# EAGLE board PROIECT_TSC (EAGLE 9.7.0)
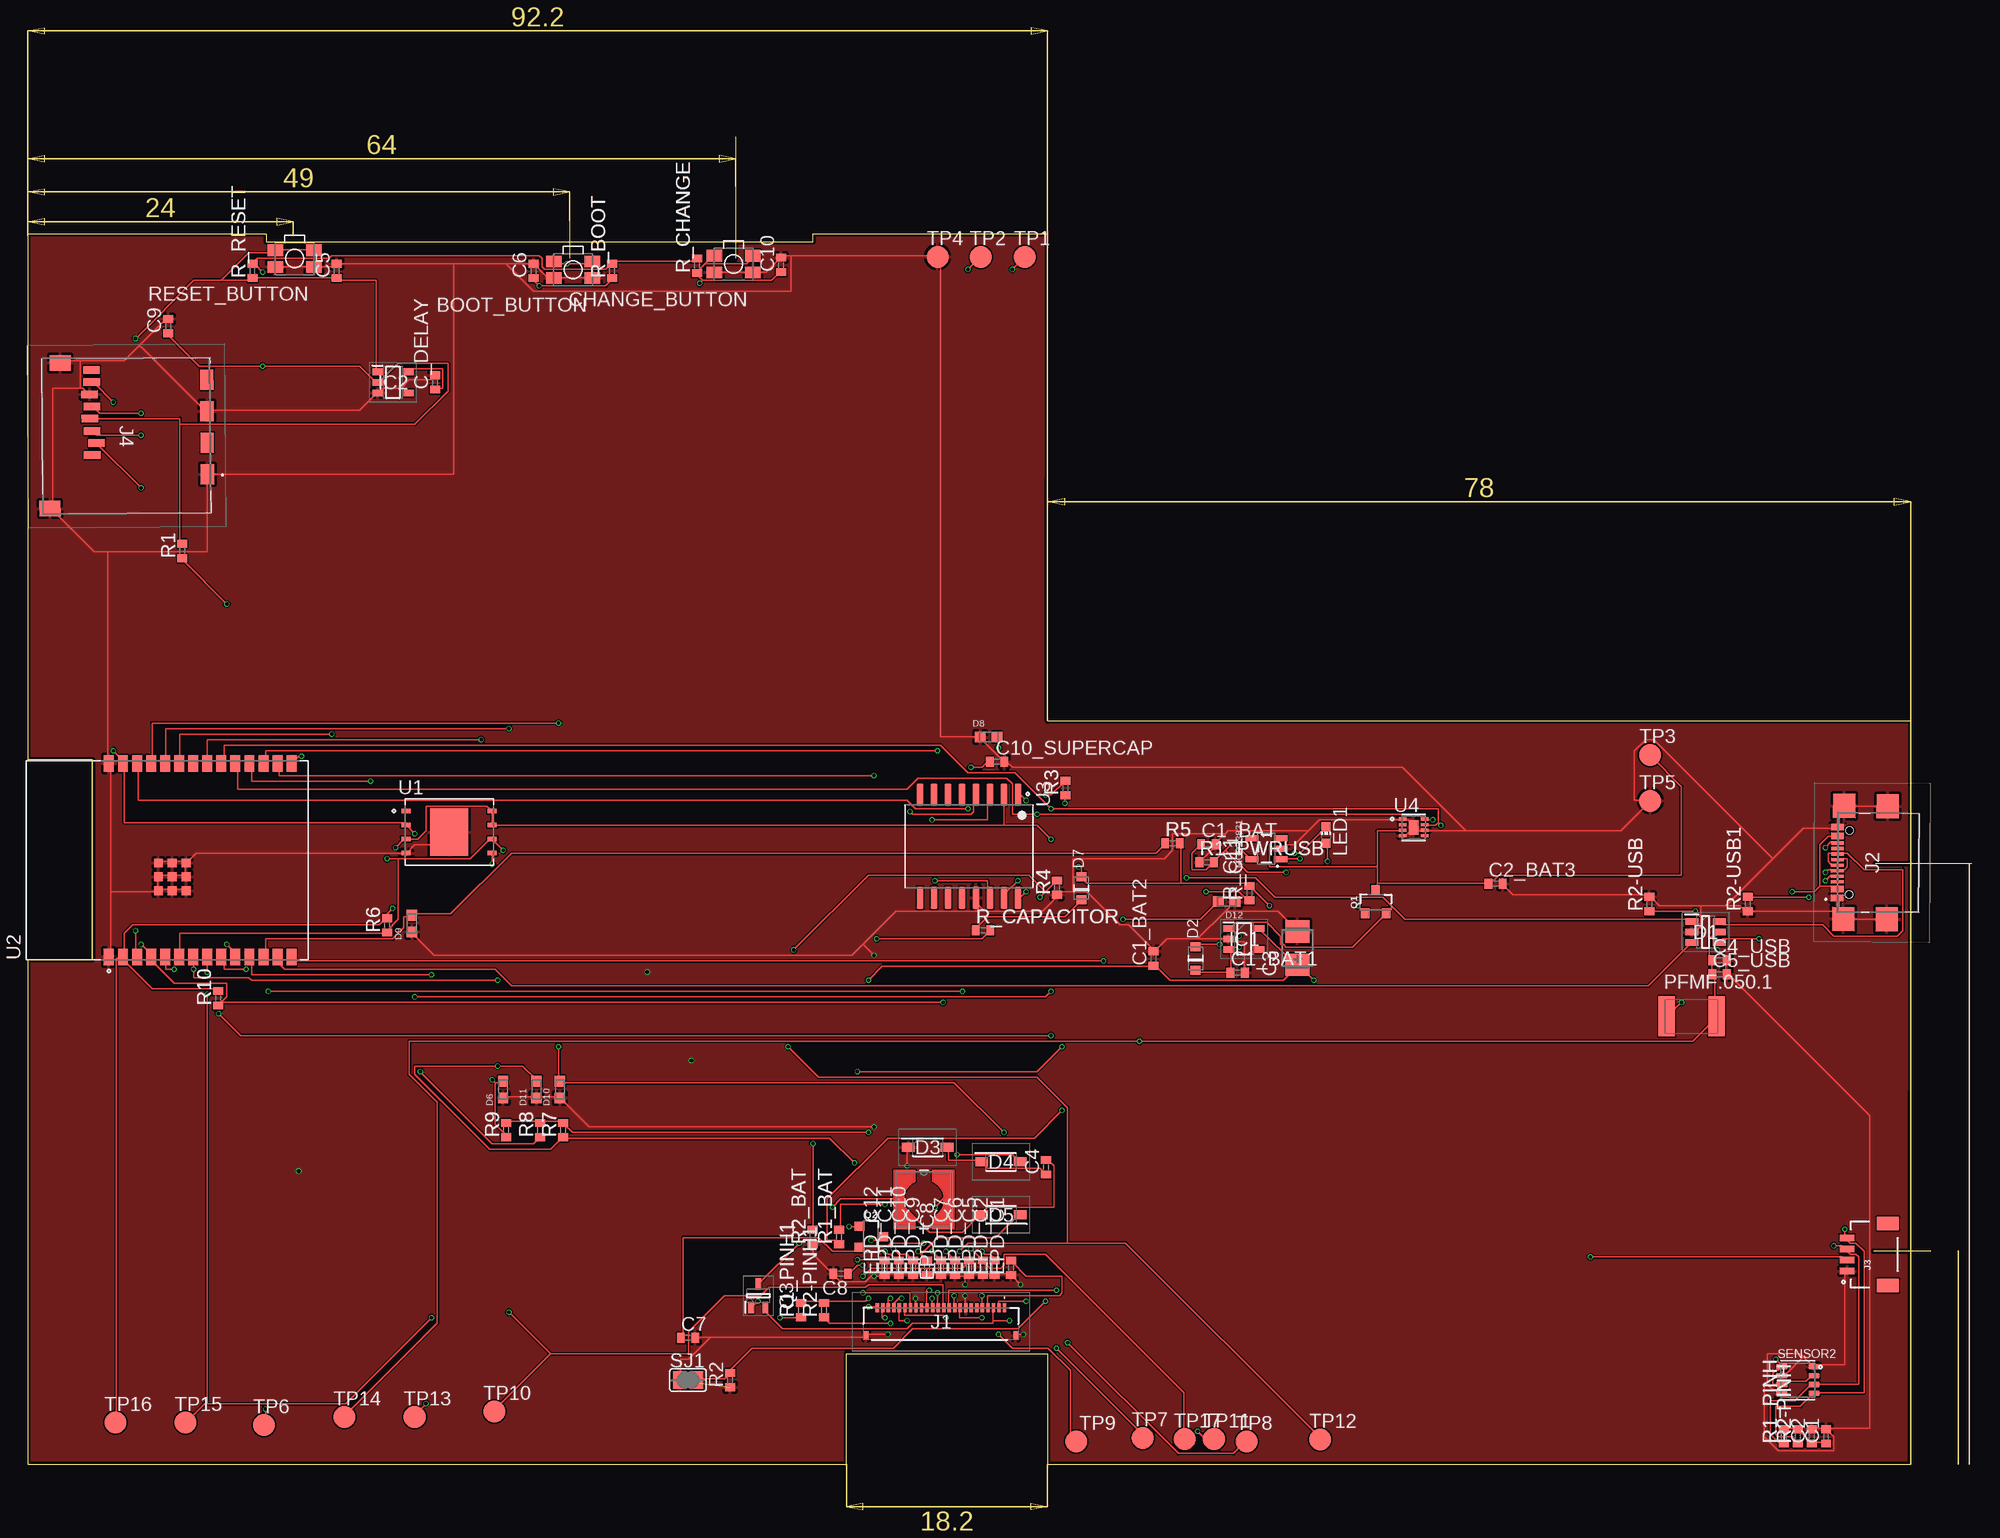
[diagram p1: board, top side]
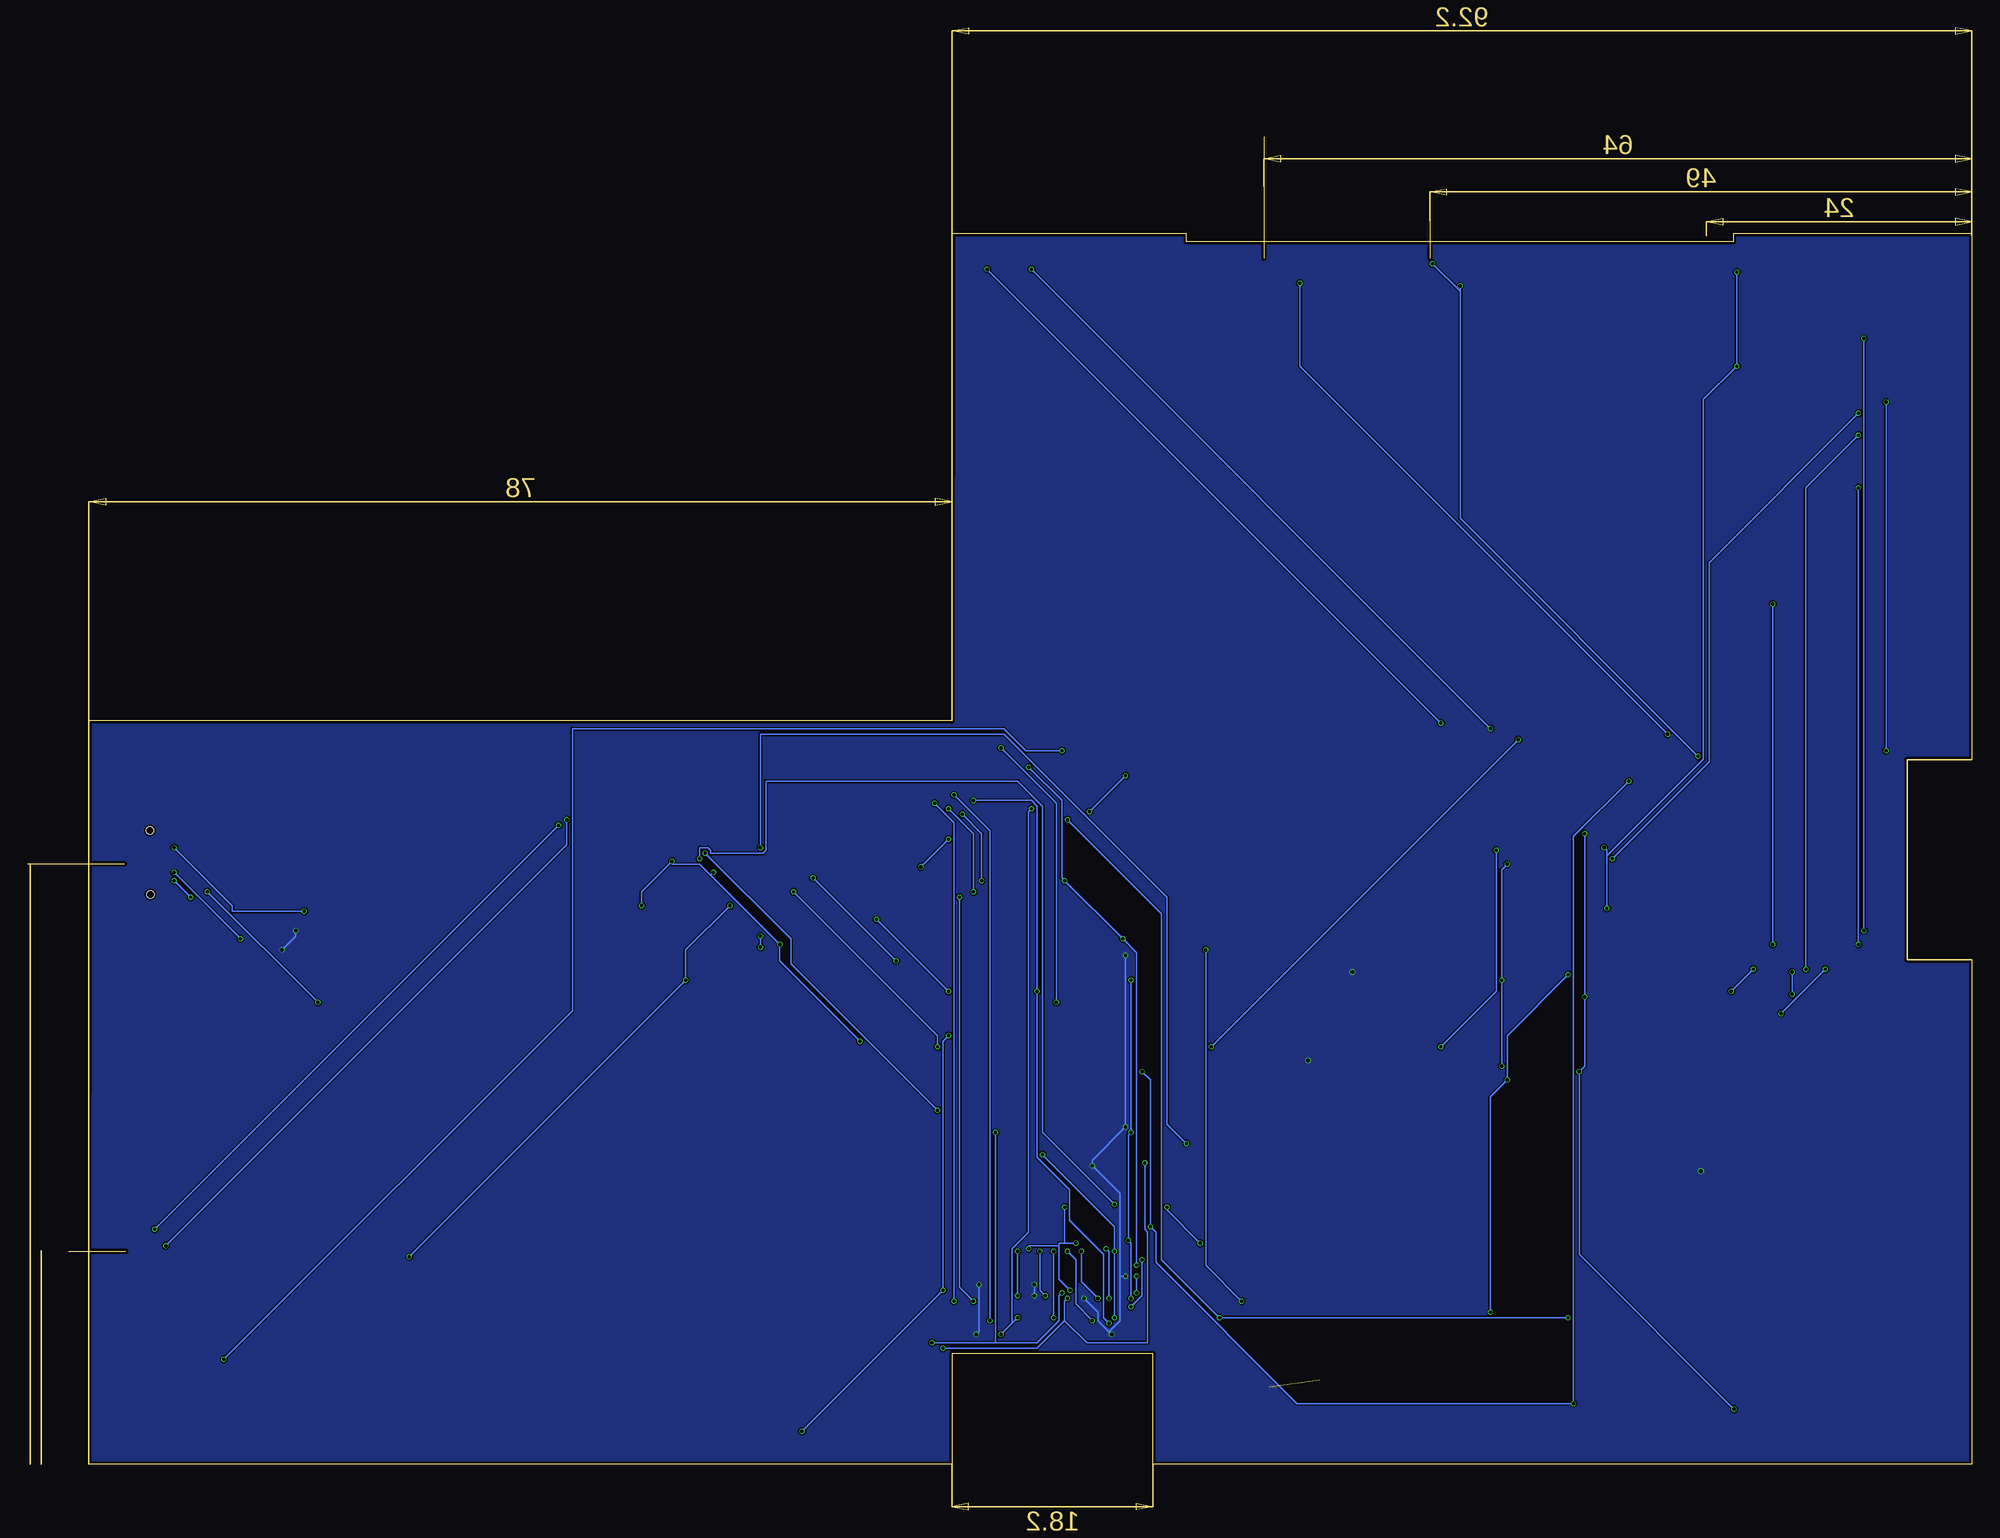
[diagram p2: board, bottom side, seen from below]

Size 175.74 x 120 mm. Coordinates in mm from the lower left corner, seen from the top.
Outline: 92.2,0 160,0
Outline: 0,100 0,63.68
Outline: 92.2,0 170.2,0 170.2,67.2 92.2,67.2 92.2,111.2 71,111.2 71,110.5 21.54,110.5 21.54,111.2 0,111.2 0,63.68
Outline: 92.2,0 92.2,10 74,10 74,0 0,0 0,45.63 5.86,45.63 5.86,63.68 0,63.68
Outline: 64,120 64,109
Outline: 49,115 49,109
Outline: 175.74,54.28 167,54.28
Outline: 172.01,19.28 166.86,19.28
Copper layers (1*16): Top 0.035mm / dielectric 1.6mm / Bottom 0.035mm
Design rules "jlcpcb-2layers": minimum track width 5mil, minimum drill 0.3mm, track to track 5mil, track to pad 5mil, pad to pad 5mil, via to via 5mil, smd to smd 5mil, copper to edge 0.2mm, drill to drill 6mil, minimum pad ring 10mil, minimum via ring 3mil, stop-mask expansion 4mil, vias tented up to drill 0mil, thermal gap 10mil

## Footprints (pad centres in the part's own frame; a part is rotated, then mirrored left to right if it is on the bottom)
MYBUTTON = smd 1.4 x 1.05: 1 1.75,0.75; 2 -1.75,0.75; 3 -1.75,-0.75; 4 1.75,-0.75
ESP32_WROVER_EAGLE-LTSPICE_C0402 = smd 0.7 x 0.9: 1 -0.65,0; 2 0.65,0
EAGLE-LTSPICE_C0402 = smd 0.7 x 0.9: 1 -0.65,0; 2 0.65,0
RCL_CT3528 = smd 2 x 2.2: + -1.5,0; - 1.5,0
SOT95P280X145-6N = smd 1.2 x 0.6: 1 -1.25,0.95; 2 -1.25,0; 3 -1.25,-0.95; 4 1.25,-0.95; 5 1.25,0; 6 1.25,0.95
ESP32_WROVER_AVX---SD0805S020S1R0_AVX_SD0805S020S1R0_0 = smd 0.8 x 0.9: 1 -1.05,0; 2 1.05,0
SOD3716X135N = smd 1.15 x 0.8: 1 -1.75,0; 2 1.75,0
DIOC1608X36N = smd 0.97 x 0.94: 1 -0.75,0; 2 0.75,0
SOT95P280X120-5N = smd 0.9 x 0.6: 1 -1.4,0.95; 2 -1.4,0; 3 -1.4,-0.95; 4 1.4,-0.95; 5 1.4,0.95
SOT95P280X125-5N = smd 0.9 x 0.6: 1 -1.4,0.95; 2 -1.4,0; 3 -1.4,-0.95; 4 1.4,-0.95; 5 1.4,0.95
FH34SRJ24S05SH99 = smd 0.3 x 0.8: 1 5.75,1.45; 2 5.25,1.45; 3 4.75,1.45; 4 4.25,1.45; 5 3.75,1.45; 6 3.25,1.45; 7 2.75,1.45; 8 2.25,1.45; 9 1.75,1.45; 10 1.25,1.45; 11 0.75,1.45; 12 0.25,1.45; 13 -0.25,1.45; 14 -0.75,1.45; 15 -1.25,1.45; 16 -1.75,1.45; 17 -2.25,1.45; 18 -2.75,1.45; 19 -3.25,1.45; 20 -3.75,1.45; 21 -4.25,1.45; 22 -4.75,1.45; 23 -5.25,1.45; 24 -5.75,1.45 | smd 0.4 x 0.8: MP1 6.75,-1.05; MP2 -6.75,-1.05
SAMACSYS_PARTS_USB4110GFA = smd 0.3 x 1.15: A1 -3.35,3.678; A4 -2.55,3.678; A5 -1.25,3.678; A6 -0.25,3.678; A7 0.25,3.678; A8 1.25,3.678; A9 2.55,3.678; A12 3.35,3.678; B1 3.05,3.678; B4 2.25,3.678; B5 1.75,3.678; B6 0.75,3.678; B7 -0.75,3.678; B8 -1.75,3.678; B9 -2.25,3.678; B12 -3.05,3.678 | smd 2.18 x 2: MP1 -5.11,-0.827; MP2 5.11,-0.827; MP3 -5.11,3.103; MP4 5.11,3.103 | hole 0.65: -2.89,2.603; 2.89,2.603
JST04_1MM_RA = smd 0.6 x 1.35: 1 -1.5,0; 2 -0.5,0; 3 0.5,0; 4 1.5,0 | smd 1.2 x 2: NC1 2.8,-3.675; NC2 -2.8,-3.675
112ATAARR03ATTEND = smd 1.8 x 1.2: G1 10.6,10.4; G2 4.9,10.4; S1 7.75,10.4; S2 2.05,10.4 | smd 1.4 x 1.9: G3 13.6,-3.85; G4 0.45,-2.85 | smd 0.7 x 1.5: P1 8.8,0; P2 7.7,0.4; P3 6.6,0; P4 5.5,-0.2; P5 4.4,0; P6 3.3,-0.2; P7 2.2,0; P8 1.1,0
IND_4828-WE-TPC_WRE = smd 0.127 x 0.127: 1 -2.286,0; 2 2.286,0
ADAFRUIT_CHIP-LED0603 = smd 0.8 x 0.8: A 0,-0.75; C 0,0.75
ESP32_WROVER_SPARKFUN-IC-POWER_SOT23-5 = smd 0.55 x 1.2: 1 -0.95,-1.3; 2 0,-1.3; 3 0.95,-1.3; 4 0.95,1.3; 5 -0.95,1.3
ESP32C6_VARISTOR_CT/CN1812 = smd 1.5 x 3.6: 1 -2.25,0; 2 2.25,0
ESP32_WROVER_SPARKFUN-DISCRETESEMI_SOT23-3 = smd 0.8 x 0.9: 1 -0.95,-1; 2 0.95,-1; 3 0,1.1
SOT65P210X110-3N = smd 1.05 x 0.5: 1 -1.05,0.65; 2 -1.05,-0.65; 3 1.05,0
ESP32_WROVER_EAGLE-LTSPICE_R0402 = smd 0.7 x 0.9: 1 -0.65,0; 2 0.65,0
ESP32_WROVER_BME680_PSON80P300X300X100-8N = smd 1.016 x 0.5: 1 1.458,1.2; 2 1.458,0.4; 3 1.458,-0.4; 4 1.458,-1.2; 5 -1.458,-1.22; 6 -1.458,-0.4; 7 -1.458,0.4; 8 -1.458,1.2
SJ = smd 1.168 x 1.6: 1 -0.762,0; 2 0.762,0
TP20R = smd 2 x 2: TP 0,0
SON127P600X800X80-9N = smd 0.94 x 0.44: 1 -3.895,1.905; 2 -3.895,0.635; 3 -3.895,-0.635; 4 -3.895,-1.905; 5 3.895,-1.905; 6 3.895,-0.635; 7 3.895,0.635; 8 3.895,1.905 | smd 3.4 x 4.3: 9 0,0
XCVR_ESP32-C6-WROOM-1-N8 = smd 1.5 x 0.9: 1 -8.75,5.26; 2 -8.75,3.99; 3 -8.75,2.72; 4 -8.75,1.45; 5 -8.75,0.18; 6 -8.75,-1.09; 7 -8.75,-2.36; 8 -8.75,-3.63; 9 -8.75,-4.9; 10 -8.75,-6.17; 11 -8.75,-7.44; 12 -8.75,-8.71; 13 -8.75,-9.98; 14 -8.75,-11.25; 15 8.75,-11.25; 16 8.75,-9.98; 17 8.75,-8.71; 18 8.75,-7.44; 19 8.75,-6.17; 20 8.75,-4.9; 21 8.75,-3.63; 22 8.75,-2.36; 23 8.75,-1.09; 24 8.75,0.18; 25 8.75,1.45; 26 8.75,2.72; 27 8.75,3.99; 28 8.75,5.26 | smd 0.8 x 0.8: 29_1 -2.755,0.79; 29_2 -1.505,0.79; 29_3 -0.255,0.79; 29_4 -2.755,-0.46; 29_5 -1.505,-0.46; 29_6 -0.255,-0.46; 29_7 -2.755,-1.71; 29_8 -1.505,-1.71; 29_9 -0.255,-1.71
SOIC127P1032X265-16N = smd 2.05 x 0.59: 1 -4.655,4.445; 2 -4.655,3.175; 3 -4.655,1.905; 4 -4.655,0.635; 5 -4.655,-0.635; 6 -4.655,-1.905; 7 -4.655,-3.175; 8 -4.655,-4.445; 9 4.655,-4.445; 10 4.655,-3.175; 11 4.655,-1.905; 12 4.655,-0.635; 13 4.655,0.635; 14 4.655,1.905; 15 4.655,3.175; 16 4.655,4.445
SON50P200X200X80-9N = smd 0.76 x 0.27: 1 -0.985,0.75; 2 -0.985,0.25; 3 -0.985,-0.25; 4 -0.985,-0.75; 5 0.985,-0.75; 6 0.985,-0.25; 7 0.985,0.25; 8 0.985,0.75 | smd 0.9 x 1.3: 9 0,0

## Placement (x,y rotation side)
BOOT_BUTTON  BUTTON_CUSYOMV1  [MYBUTTON]  49.3,107.97 180 top
C1  100nF  [ESP32_WROVER_EAGLE-LTSPICE_C0402]  162.56,2.54 90 top
C1_BAT  4.7uF  [ESP32_WROVER_EAGLE-LTSPICE_C0402]  106.73,56.05 0 top
C1_BAT1  4.7uF  [ESP32_WROVER_EAGLE-LTSPICE_C0402]  109.38,44.45 0 top
C1_BAT2  4.7uF  [EAGLE-LTSPICE_C0402]  101.76,45.72 90 top
C2  100nF  [ESP32_WROVER_EAGLE-LTSPICE_C0402]  161.29,2.54 90 top
C2_BAT3  4.7uF  [ESP32_WROVER_EAGLE-LTSPICE_C0402]  132.68,52.47 0 top
C3  100uF  [RCL_CT3528]  114.77,46.66 90 top
C4  4.7uF/25V  [ESP32_WROVER_EAGLE-LTSPICE_C0402]  92.06,26.86 90 top
C4_USB  100nF  [EAGLE-LTSPICE_C0402]  152.94,45.57 0 top
C5  1uF  [ESP32_WROVER_EAGLE-LTSPICE_C0402]  27.94,107.86 90 top
C5_USB  4.7uF  [EAGLE-LTSPICE_C0402]  152.94,44.3 0 top
C6  100nF  [ESP32_WROVER_EAGLE-LTSPICE_C0402]  45.72,107.86 90 top
C7  10uF  [EAGLE-LTSPICE_C0402]  59.69,11.43 0 top
C8  100nF  [ESP32_WROVER_EAGLE-LTSPICE_C0402]  73.48,17.23 180 top
C9  100nF  [ESP32_WROVER_EAGLE-LTSPICE_C0402]  12.7,102.87 90 top
C10  100nF  [ESP32_WROVER_EAGLE-LTSPICE_C0402]  68.12,108.41 90 top
C10_SUPERCAP  [ESP32_WROVER_EAGLE-LTSPICE_C0402]  87.63,63.5 0 top
C_DELAY  100nF  [ESP32_WROVER_EAGLE-LTSPICE_C0402]  36.83,97.79 90 top
CHANGE_BUTTON  BUTTON_CUSYOMV1  [MYBUTTON]  63.8,108.47 180 top
D1  USBLC6-2SC6Y  [SOT95P280X145-6N]  151.67,48.11 0 top
D2  ESP32_WROVER_AVX---SD0805S020S1R0_AVX_SD0805S020S1R0_0_0AVX_SD0805S020S1R0_0_0  [ESP32_WROVER_AVX---SD0805S020S1R0_AVX_SD0805S020S1R0_0]  105.57,45.72 90 top
D3  MBR0530  [SOD3716X135N]  81.36,28.67 0 top
D4  MBR0530  [SOD3716X135N]  87.98,27.36 0 top
D5  MBR0530  [SOD3716X135N]  87.98,22.55 180 top
D6  PGB1010603MR  [DIOC1608X36N]  42.98,33.87 90 top
D7  ESP32_WROVER_AVX---SD0805S020S1R0_AVX_SD0805S020S1R0_0_0AVX_SD0805S020S1R0_0_0  [ESP32_WROVER_AVX---SD0805S020S1R0_AVX_SD0805S020S1R0_0]  95.25,52.07 90 top
D8  PGB1010603MR  [DIOC1608X36N]  86.86,65.74 0 top
D9  PGB1010603MR  [DIOC1608X36N]  34.74,48.87 90 top
D10  PGB1010603MR  [DIOC1608X36N]  48.12,33.87 90 top
D11  PGB1010603MR  [DIOC1608X36N]  46,33.87 90 top
D12  PGB1010603MR  [DIOC1608X36N]  108.38,50.87 180 top
EPD_C1  1uF/50V  [ESP32_WROVER_EAGLE-LTSPICE_C0402]  88.9,17.78 90 top
EPD_C2  1uF/50V  [ESP32_WROVER_EAGLE-LTSPICE_C0402]  87.41,17.78 90 top
EPD_C5  1uF/50V  [ESP32_WROVER_EAGLE-LTSPICE_C0402]  86.36,17.78 90 top
EPD_C6  1uF/50V  [ESP32_WROVER_EAGLE-LTSPICE_C0402]  85.09,17.78 90 top
EPD_C7  1uF/50V  [ESP32_WROVER_EAGLE-LTSPICE_C0402]  83.82,17.78 90 top
EPD_C8  1uF/50V  [ESP32_WROVER_EAGLE-LTSPICE_C0402]  82.55,17.78 90 top
EPD_C9  1uF/50V  [ESP32_WROVER_EAGLE-LTSPICE_C0402]  81.28,17.78 90 top
EPD_C10  1uF/50V  [ESP32_WROVER_EAGLE-LTSPICE_C0402]  80.01,17.78 90 top
EPD_C11  1uF/50V  [ESP32_WROVER_EAGLE-LTSPICE_C0402]  78.74,17.78 90 top
EPD_C12  1uF/50V  [ESP32_WROVER_EAGLE-LTSPICE_C0402]  77.47,17.78 90 top
IC1  XC6220A331MR-G  [SOT95P280X120-5N]  109.96,47.49 0 top
IC2  BD5229G-TR  [SOT95P280X125-5N]  33.02,97.79 0 top
J1  FH34SRJ-24S-0.5SH_99_  [FH34SRJ24S05SH99]  82.55,12.7 0 top
J2  SAMACSYS_PARTS_USB4110-GF-A  [SAMACSYS_PARTS_USB4110GFA]  167.26,54.38 89.6 top
J3  QWIIC_RIGHT_ANGLE  [JST04_1MM_RA]  164.46,18.97 90 top
J4  112A-TAAR-R03_ATTEND  [112ATAARR03ATTEND]  5.78,100.01 270.4 top
L1  68uH  [IND_4828-WE-TPC_WRE]  81.01,23.94 0 top
LED1  [ADAFRUIT_CHIP-LED0603]  117.36,56.89 0 top
MCP73831  ESP32_WROVER_SPARKFUN-IC-POWER_MCP73831  [ESP32_WROVER_SPARKFUN-IC-POWER_SOT23-5]  111.96,55.65 90 top
PFMF.050.1  ESP32C6_VARISTORCN1812  [ESP32C6_VARISTOR_CT/CN1812]  150.4,40.49 0 top
Q1  20V/4.2A/52mΩ/1.4W  [ESP32_WROVER_SPARKFUN-DISCRETESEMI_SOT23-3]  121.85,50.8 0 top
Q2  20V/4.2A/52mΩ/1.4W  [ESP32_WROVER_SPARKFUN-DISCRETESEMI_SOT23-3]  76.2,20.59 270 top
Q3  SI1308EDL-T1-GE3  [SOT65P210X110-3N]  66.04,15.24 90 top
R1  10K  [ESP32_WROVER_EAGLE-LTSPICE_R0402]  13.97,82.55 90 top
R1_BAT  200  [ESP32_WROVER_EAGLE-LTSPICE_R0402]  73.34,20.55 90 top
R1_PINH  10K  [ESP32_WROVER_EAGLE-LTSPICE_R0402]  158.75,2.54 90 top
R1_PINH1  10K  [ESP32_WROVER_EAGLE-LTSPICE_R0402]  69.89,13.95 90 top
R1_PWRUSB  100k  [ESP32_WROVER_EAGLE-LTSPICE_R0402]  106.58,54.42 0 top
R2  2.2  [ESP32_WROVER_EAGLE-LTSPICE_R0402]  63.5,7.62 90 top
R2-PINH  10K  [ESP32_WROVER_EAGLE-LTSPICE_R0402]  160.02,2.54 90 top
R2-PINH1  10K  [ESP32_WROVER_EAGLE-LTSPICE_R0402]  71.97,13.95 90 top
R2-USB  5K1  [ESP32_WROVER_EAGLE-LTSPICE_R0402]  146.59,50.65 90 top
R2-USB1  5K1  [ESP32_WROVER_EAGLE-LTSPICE_R0402]  155.48,50.65 90 top
R2_BAT  2K  [ESP32_WROVER_EAGLE-LTSPICE_R0402]  70.95,20.55 90 top
R3  0.47  [ESP32_WROVER_EAGLE-LTSPICE_R0402]  93.8,61.13 90 top
R4  10K  [ESP32_WROVER_EAGLE-LTSPICE_R0402]  93.06,52.13 90 top
R5  10K  [ESP32_WROVER_EAGLE-LTSPICE_R0402]  103.48,56.13 0 top
R6  10K  [ESP32_WROVER_EAGLE-LTSPICE_R0402]  32.49,48.71 90 top
R7  10K  [ESP32_WROVER_EAGLE-LTSPICE_R0402]  48.41,30.21 90 top
R8  10K  [ESP32_WROVER_EAGLE-LTSPICE_R0402]  46.33,30.21 90 top
R9  10K  [ESP32_WROVER_EAGLE-LTSPICE_R0402]  43.25,30.21 90 top
R10  10K  [ESP32_WROVER_EAGLE-LTSPICE_R0402]  17.22,42.13 90 top
R_BOOT  10K  [ESP32_WROVER_EAGLE-LTSPICE_R0402]  52.84,107.86 90 top
R_C11  10K  [ESP32_WROVER_EAGLE-LTSPICE_R0402]  110.45,51.63 90 top
R_CAPACITOR  15  [ESP32_WROVER_EAGLE-LTSPICE_R0402]  86.36,48.26 0 top
R_CHANGE  10K  [ESP32_WROVER_EAGLE-LTSPICE_R0402]  60.5,108.32 90 top
R_RESET  10K  [ESP32_WROVER_EAGLE-LTSPICE_R0402]  20.32,107.86 90 top
RESET_BUTTON  BUTTON_CUSYOMV1  [MYBUTTON]  24.13,108.97 180 top
SENSOR2  ESP32_WROVER_BME680_BME680  [ESP32_WROVER_BME680_PSON80P300X300X100-8N]  160.02,7.62 0 top
SJ1  [SJ]  59.69,7.62 0 top
TP1  TPTP20R  [TP20R]  90.13,109.13 0 top
TP2  TPTP20R  [TP20R]  86.13,109.13 0 top
TP3  TPTP20R  [TP20R]  146.67,64.13 0 top
TP4  TPTP20R  [TP20R]  82.26,109.13 0 top
TP5  TPTP20R  [TP20R]  146.67,59.96 0 top
TP6  TPTP20R  [TP20R]  21.36,3.57 0 top
TP7  TPTP20R  [TP20R]  100.78,2.39 0 top
TP8  TPTP20R  [TP20R]  110.2,2.07 0 top
TP9  TPTP20R  [TP20R]  94.77,2.07 0 top
TP10  TPTP20R  [TP20R]  42.18,4.78 0 top
TP11  TPTP20R  [TP20R]  107.23,2.28 0 top
TP12  TPTP20R  [TP20R]  116.83,2.25 0 top
TP13  TPTP20R  [TP20R]  34.98,4.28 0 top
TP14  TPTP20R  [TP20R]  28.63,4.28 0 top
TP15  TPTP20R  [TP20R]  14.28,3.78 0 top
TP16  TPTP20R  [TP20R]  7.93,3.78 0 top
TP17  TPTP20R  [TP20R]  104.58,2.28 0 top
U1  W25Q512JVEIQ  [SON127P600X800X80-9N]  38.1,57.15 0 top
U2  ESP32-C6-WROOM-1-N8  [XCVR_ESP32-C6-WROOM-1-N8]  12.61,54.61 90 top
U3  DS3231SN#  [SOIC127P1032X265-16N]  85.09,55.88 270 top
U4  MAX17048G+T10  [SON50P200X200X80-9N]  125.28,57.57 0 top

## Tracks (layer width: path | path; a pad name or v marks a point on that pad's centre or on a via)
2C_PW
  Top 0.127: C1.1 162.5,2 161.5,2 C2.1 161.25,2 160.25,3 R2-PINH.2 160,3.25 158.75,3.25 R1_PINH.2
3V3  (via drill 0.3)
  Top 0.127: R9.2 43.25,31 46.25,31 R8.2 46.5,31 48.25,31 R7.2 48.5,30.75 49.25,30 v76,30 | R1_PINH1.2 70,14.75 71.75,14.75 R2-PINH1.2 72,14.75 75.75,14.75 v76,15 | v76.25,20.25 77,20.25 77.25,20.5 Q2.3 | 104.25,52.5 110.25,52.5 R_C11.2 110.5,52.25 v112.25,50.5 | 104.25,52.5 95.75,52.5 95.25,53 D7.2 95.25,54 v95,54 | 104.25,52.5 104.25,56 R5.2 | C3.+ 114.75,45 113.5,43.75 103.25,43.75 102,45 C1_BAT2.1 101.75,45 77.25,45 v76,43.75 | IC1.5 111.5,48.25 114.5,45.25 114.75,45.25 C3.+ | v141.25,18.75 164,18.75 164.25,18.5 J3.2 | v116.25,43.75 115,45 C3.+ | R_CHANGE.2 60.5,108.75 53,108.75 R_BOOT.2 52.75,108.5 52.25,108 46.75,108 46.5,108.25 46.5,109 46.25,109.25 27.5,109.25 27.25,109 20.75,109 20.5,108.75 R_RESET.2 20.5,108.5 v21.25,107.75 | 13.75,94 13.75,94.5 5.75,94.5 J4.P4 | 13.75,94 13.75,83.25 R1.2 | C9.1 12.75,102 15.5,99.25 v21.25,99.25 30,99.25 31.25,98 31.5,98 IC2.2 31.75,98 32,98 33.5,99.5 38,99.5 38,97 35,94 13.75,94 | 88.25,57.75 88.25,60.5 U3.2 | 88.25,57.75 42,57.75 U1.7 42,58 42,59 U1.8 41.75,59.25 41.5,59.5 36,59.5 36,57.25 35.25,56.5 34.25,56.5 U1.3 34,56.5 v33.25,55.75 | 8.5,45.75 11.25,43 17,43 R10.2 | 8.5,45.75 8,45.75 8,4 TP16.TP | 8.5,45.75 U2.2 8.75,46 8.75,48 9.5,48.75 31.75,48.75 32.25,49.25 R6.2 32.25,49.5 v33,50.25 | v92.5,56.5 91.25,57.75 88.25,57.75
  Bottom 0.127: v76,15 76,20 v76.25,20.25 76.25,29.75 v76,30 v76,43.75 | v141.25,18.75 v116.25,43.75 116.25,46.5 v112.25,50.5 | v21.25,107.75 v21.25,99.25 24.25,96.25 24.25,63.75 33,55 | v33.25,55.75 33,55.5 33,55 | v33,50.25 33,55 | v92.5,56.5 v95,54
32KHZ  (via drill 0.3)
  Top 0.127: v78,12.75 72.5,12.75 72,13.25 R2-PINH1.1 | v90.25,60 89.75,60.5 U3.1 | v19.75,44.75 17.75,44.75 17.75,45.75 U2.9 | v84.5,42.75 v21.75,42.75
  Bottom 0.127: v78,12.75 78.5,13.25 78.5,19 81.58,22.08 81.58,24.83 84.5,27.75 v84.5,42.75 84.5,59.5 85,60 v90.25,60 | v21.75,42.75 v19.75,44.75
DN  (via drill 0.3)
  Top 0.127: J2.A7 163.75,54.75 164.5,54.75 164.5,54 164.25,53.75 163.75,53.75 J2.B7 163.5,53.75 162.75,53.75 v162.5,53.5 | v156.5,47.5 153.25,47.5 153,47.25 D1.4
  Bottom 0.127: v162.5,53.5 v156.5,47.5
DP
  Top 0.127: J2.A6 163.5,54.25 163,54.25 162.75,54.5 162.75,55.25 163.5,55.25 J2.B6 163.75,55.25 164.5,55.25 166,53.75 169.5,53.75 169.5,48.25 169,47.75 163.25,47.75 162.25,48.75 153.25,48.75 153,49 D1.6
EPD_3V3  (via drill 0.3)
  Top 0.127: C7.1 59.25,11.5 59.25,20.5 71.5,20.5 72.75,19.25 74.75,19.25 75,19.5 Q2.2 75.25,19.75 77.75,19.75 78,20 v81,20 | 81.25,14.25 80.75,14.25 J1.16 | 81.25,14.25 81.25,15.75 v81.5,15.75 | v82,23.25 83.03,24.28 L1.2 | 81.25,14.25 J1.15 | TP17.TP 104.5,2.5 104.5,6.5 92,19 88.25,19 88.25,18 88,17.75 87,17.75 86.5,18.25 EPD_C5.2 86.25,18.5 v85.25,19.5
  Bottom 0.127: v81.5,15.75 82.5,16.75 82.5,19.75 | v82,23.25 82,20 | 82.5,19.75 82.5,20 82,20 | 82.5,19.75 85.25,19.75 v85.25,19.5 | 82,20 v81,20
EPD_3V3_C  (via drill 0.3)
  Top 0.127: v74.25,21.5 75,21.5 Q2.1 | v36,5.5 35,4.5 TP13.TP | v106.5,51.75 109.5,51.75 110.25,51 R_C11.1 | v93.5,37.75 91.25,35.5 v75,35.5 | v31,61.75 20.25,61.75 20.25,63.25 U2.18
  Bottom 0.127: v106.5,51.75 93.5,38.75 v93.5,37.75 | v75,35.5 74.25,34.75 v74.25,21.5 73.75,21 73.75,18.25 61,5.5 v36,5.5 36,56.75 v31,61.75
EPD_BUSY  (via drill 0.3)
  Top 0.127: v86.25,13.25 84.25,13.25 84.25,14 J1.9 | v87.75,11.75 89,10.5 92.25,10.5 94.25,8.5 94.25,2.25 94.75,2.25 TP9.TP | v85,59.25 80.25,59.25 79.5,60 10,60 10,63.25 U2.26
  Bottom 0.127: v87.75,11.75 86.75,12.75 | 86.75,12.75 v86.25,13.25 | v85,59.25 85.25,59 85.25,21 86.75,19.5 86.75,12.75
EPD_CS  (via drill 0.3)
  Top 0.127: 42.25,34.5 42.25,30.75 43.25,29.75 R9.1 | 42.25,34.5 42.75,34.5 D6.2 | v36.5,44.25 20.25,44.25 20.25,45.75 U2.11 | 42.25,34.5 v42,34.75 | 47.25,10 59.75,10 59.75,12 63,15.25 66.25,15.25 67,16 75.75,16 76,16.25 82.75,16.25 82.75,14.25 J1.12 | 47.25,10 42.25,5 TP10.TP | 47.25,10 v43.5,13.75
  Bottom 0.127: v36.5,44.25 42,38.75 v42,34.75 43.5,33.25 v43.5,13.75
EPD_DC  (via drill 0.3)
  Top 0.127: v93,15.75 83.25,15.75 83.25,14.25 J1.11 | v105.75,3 106.25,2.5 107,2.5 TP11.TP | v13.25,44.75 12.5,44.75 12.5,45.75 U2.5 | v17.25,40.75 19.25,38.75 v92.5,38.75
  Bottom 0.127: v105.75,3 v93,15.75 93,38.25 v92.5,38.75 | v17.25,40.75 v13.25,44.75
EPD_RST  (via drill 0.3)
  Top 0.127: v83.75,15.25 83.75,14.25 J1.10 | v84.25,19.25 85,20 94,20 | 94,20 99.25,20 116.75,2.5 TP12.TP | v41,65.5 16.25,65.5 16.25,63.5 U2.21 | v68.75,37.75 71.5,35 91.25,35 94,32.25 94,20
  Bottom 0.127: v83.75,15.25 84.25,15.75 v84.25,19.25 | v68.75,37.75 v41,65.5
FLASH_CS
  Top 0.127: R5.1 102.75,56 102,55.25 43.75,55.25 38.25,49.75 34.75,49.75 D9.2 34.5,49.5 34,49.5 34,48.5 33,47.5 21.5,47.5 21.5,46 U2.12
GDR  (via drill 0.3)
  Top 0.127: v90.25,14.75 87.75,14.75 87.75,14.25 J1.2 | 92,51.75 93,52.75 R4.2 | 92,51.75 v91.5,51.25 | v66,14.75 65.5,14.25 Q3.1 | v69.25,46.5 76,53.25 90.5,53.25 92,51.75
  Bottom 0.127: v90.25,14.75 91.5,16 v91.5,51.25 | v66,14.75 69.25,18 v69.25,46.5
GND  (via drill 0.3, 0.35)  (1 unrouted)
  Top 0.127: CHANGE_BUTTON.1 62.25,107.75 65.5,107.75 CHANGE_BUTTON.2 65.75,107.75 66.75,107.75 68,109 C10.2 68.25,109.25 69,109.25 | 69,109.25 82.25,109.25 TP4.TP 82.5,109 82.5,65.75 86,65.75 D8.1 86.25,65.5 88.25,63.5 C10_SUPERCAP.2 88.5,63.5 89,63 124.25,63 130,57.25 | RESET_BUTTON.1 22.5,108.25 25.75,108.25 RESET_BUTTON.2 26,108.25 27.5,108.25 27.75,108.5 C5.2 28,108.5 38.5,108.5 | BOOT_BUTTON.2 51,107.25 47.75,107.25 BOOT_BUTTON.1 47.5,107.25 47,107.25 45.75,108.5 C6.2 45.5,108.5 43.25,108.5 | 43.25,108.5 38.5,108.5 | 69,109.25 69,106 45.75,106 43.25,108.5 | U1.9 38,57 37,56 35,56 34.25,55.25 U1.4 34,55.25 15.25,55.25 14.5,54.5 U2.29_9 | U2.29_3 12,54.5 13,54.5 U2.29_6 13.25,54.5 14.25,54.5 U2.29_9 | U2.29_1 11.75,52 11.75,53 U2.29_2 12,53.25 13,53.25 U2.29_5 13.25,53.25 14.25,53.25 | U2.29_1 12,52 13,52 U2.29_4 13.25,52 14.25,52 U2.29_7 | 7.5,51.75 7.5,46 U2.1 | 7.5,51.75 11.75,51.75 U2.29_1 | 7.5,51.75 7.5,63.25 U2.28 7.25,63.5 7.25,82.5 | 14.25,53.25 14.25,54.25 U2.29_9 | 14.25,53.25 U2.29_8 | 7.25,82.5 6,82.5 2.25,86.25 J4.G3 2.25,86.5 2.25,97.25 4.75,97.25 | 7.25,82.5 16.25,82.5 16.25,89.25 J4.G1 16.5,89.5 38.5,89.5 38.5,108.5 | C_DELAY.2 36.75,98.25 36.5,98 34.5,98 33.75,97.25 32,97.25 31.75,97 IC2.3 31.5,96.75 30,95.25 16.25,95.25 J4.G2 16,95.25 10.25,101 10,101 | 10,101 8.75,99.75 4.75,99.75 | 10,101 12.5,103.5 C9.2 | 4.75,99.75 3,99.75 J4.G4 | 4.75,97.25 5,97.25 5.5,96.75 J4.P6 | 4.75,99.75 4.75,97.25 | v90,11.75 89.25,11.75 J1.MP1 | v89.75,16.25 89,17 EPD_C1.1 88.75,17.25 87.5,17.25 EPD_C2.1 87.25,17.25 86.5,17.25 EPD_C5.1 86.25,17.25 85.25,17.25 EPD_C6.1
  Top 0.127: v84.75,15.25 84.75,14.25 J1.8 | 84.75,17 v84.75,16.25 | 84.75,17 85,17 EPD_C6.1 | 84.75,17 84,17 EPD_C7.1 83.75,17.25 82.75,17.25 EPD_C8.1 82.5,17.25 81.5,17.25 EPD_C9.1 81.25,17.25 80.25,17.25 EPD_C10.1 80,17.25 78.75,17.25 EPD_C11.1 78.5,17.25 77.5,17.25 EPD_C12.1 77.25,17 v76.5,17 76.25,17 75.75,16.5 73.5,16.5 73,17 C8.2 72.75,17.25 71,19 71,19.75 R2_BAT.1 | 84.75,17 EPD_C6.1 | 46,33.25 43,33.25 D6.1 | 46,33.25 48,33.25 D10.1 48.25,33 50.75,30.5 v76.5,30.5 | 46,33.25 D11.1 | 61.75,11.5 60.5,11.5 C7.2 | 61.75,11.5 75.75,11.5 J1.MP2 75.75,11.75 v77.75,11.75 | v80.25,15 80.25,14.25 J1.17 | v79.5,27 79.5,28.5 D3.1 | 61.75,11.5 59.75,9.5 59,9.5 59,7.75 SJ1.1 | 105.75,47.5 108.5,47.5 IC1.2 108.75,47.25 110,47.25 110,44.5 C1_BAT1.2 | 105.75,47.5 103,47.5 102,46.5 C1_BAT2.2 101.75,46.5 99.5,48.75 98.75,48.75 95.75,51.75 94.5,51.75 | 105.75,47.5 108.25,50 | 108.25,50 109,50.75 D12.1 | 108.25,50 113,50 114.75,48.25 C3.- | 86.5,50 91.75,50 93,51.25 R4.1 93.25,51.5 93.5,51.75 94.5,51.75 | 86.5,50 85.5,51 U3.13 | 75.5,47 78.5,50 86.5,50 | 75.5,47 74.5,46 36.75,46 34.75,48 D9.1 | 75.5,47 v76.5,46 | C2.2 161.5,3.25 162.5,3.25 C1.2 | 157.25,7.25 157.75,6.75 158.25,6.75 158.5,6.5 SENSOR2.5 | 157.25,7.25 157.25,10 160.25,10 160.5,9.75 | 160.5,9.75 161.25,9 SENSOR2.1 161.5,9 164.25,9 164.25,17.25 J3.1 | 160.5,9.75 159,8.25 158.75,8.25 SENSOR2.7 | C1.2 163.25,2.5 163.25,1.25 158.25,1.25 157,2.5 157,7.25 157.25,7.25 | C1.2 162.75,3.25 166.5,3.25 166.5,31.5 153.75,44.25 C5_USB.2 153.5,44.5 153.5,45.5 C4_USB.2 153.5,45.75 v152.75,46.5 | J2.B12 163.5,51.25 163.5,51 J2.A1 163.75,51 163.75,50
  Top 0.127: 163.75,50 163.75,49.5 164,49.5 J2.MP3 | J2.MP1 168,49.25 164.25,49.25 J2.MP3 | 163.75,57.75 163.75,57.5 J2.B1 163.5,57.5 160.5,57.5 157.75,54.75 | 163.75,57.75 163.75,59.5 164,59.5 J2.MP4 164.25,59.5 168,59.5 J2.MP2 | 163.75,57.75 J2.A12 | 153.5,50.5 154.75,50.5 155.25,50 R2-USB1.1 163.75,50 | 153.5,50.5 151.25,50.5 | 151.25,50.5 147.5,50.5 146.75,51.25 R2-USB.2 146.5,51.5 134.25,51.5 133.5,52.25 C2_BAT3.2 | 151.25,48.5 150.75,48.5 150.5,48.25 D1.2 | 151.25,50.5 151.25,48.5 | 153.5,50.5 157.75,54.75 | 163.75,50 J2.MP3 | R1_PWRUSB.1 106,54.5 107.5,56 C1_BAT.2 107.5,56.25 108.25,57 | 125,57.25 125.25,57.5 U4.9 | 125,57.25 124.5,56.75 U4.4 | 125,57.25 126.25,57.25 U4.6 126.5,57.25 130,57.25 | 125,57.25 U4.9 | U4.9 125.25,57.75 124.75,58.25 124.5,58.25 U4.1 124.25,58.25 116.75,58.25 115.75,57.25 | 115.75,57.25 114.5,56 113.75,56 113.5,55.75 MCP73831.2 | 108.25,57 108.5,57.25 115.75,57.25 | 130,57.25 144,57.25 146.5,59.75 TP5.TP 146.5,60 145.25,60 145.25,64.5 146.25,65.5 147,65.5 157.75,54.75 | 151.25,48.5 v151.5,48.25 | 94.5,51.75 94.5,54.75 102.75,54.75 103.5,55.5 103.5,57 108.25,57
  Bottom 0.127: v90,11.75 89.75,12 v89.75,16.25 | v84.75,16.25 v84.75,15.25 | v80.25,15 79,13.75 79,13 78,12 | v77.75,11.75 78,12 | 77,17 77,13 78,12 | 77,17 77,24.5 v79.5,27 79.5,27.5 v76.5,30.5 v76.5,46 | 77,17 v76.5,17 | v152.75,46.5 151.5,47.75 v151.5,48.25
  other vias: 24.5,26.5 60,36.5 56,44.5
  pour Bottom: 170.42,0.08 170.42,67.42 92.48,67.42 92.46,67.44 92.44,67.46 92.42,67.48 92.42,111.42 0.08,111.42 0.08,0.08
  pour Top: 170.42,0.08 170.42,67.42 92.48,67.42 92.46,67.44 92.44,67.46 92.42,67.48 92.42,111.42 0.08,111.42 0.08,0.08
GPIO8  (via drill 0.3)
  Top 0.127: v18,77.75 14,81.75 R1.1 | v18,47 19,46 U2.10
  Bottom 0.127: v18,47 v18,77.75
I2C_PW  (via drill 0.3)
  Top 0.127: SENSOR2.2 161.25,8 160.75,7.5 159,7.5 158.75,7.25 SENSOR2.6 158.5,7.25 157.75,7.25 157.75,8.25 158,8.5 158.25,8.5 158.5,8.75 SENSOR2.8 158.5,9 v158,9.5 | v82.25,64.5 21.5,64.5 21.5,63.5 U2.17
  Bottom 0.127: v82.25,64.5 85.5,64.5 87.5,66.5 126.5,66.5 126.5,41 v158,9.5
INT_RTC  (via drill 0.3)
  Top 0.127: v68,13.25 69.75,13.25 R1_PINH1.1 | v36.5,13.25 28.75,5.5 16.25,5.5 | 16.25,5.5 16,5.5 TP15.TP | v16.25,44.5 16.25,45.75 U2.8 | 16.25,5.5 v16.25,42.5 | v81.75,58.25 86.75,58.25 86.75,60.5 U3.3
  Bottom 0.127: v36.5,13.25 v68,13.25 73.25,18.5 73.25,49.75 v81.75,58.25 | v16.25,42.5 v16.25,44.5
IO/BOOT  (via drill 0.3)
  Top 0.127: BOOT_BUTTON.4 47.75,108.5 v48.75,108.5 51,108.5 BOOT_BUTTON.3 | C6.1 45.75,107 v46.25,106.5 52.25,106.5 52.75,107 R_BOOT.1 | v24.75,64 24.5,64 24,63.5 U2.15
  Bottom 0.127: v24.75,64 46.25,85.5 46.25,106 | v46.25,106.5 46.25,106 | 46.25,106 v48.75,108.5
IO/CHANGE  (via drill 0.3)
  Top 0.127: 61.25,108.5 61.75,109 62,109 CHANGE_BUTTON.4 | 61.25,108.5 60.5,107.75 R_CHANGE.1 60.5,107.5 61,107 | 61,107 67.25,107 68,107.75 C10.1 | 61.25,108.5 65,108.5 65.5,109 CHANGE_BUTTON.3 | v27.5,66 13.75,66 13.75,63.5 U2.23 | 61,107 v60.75,106.75
  Bottom 0.127: v27.5,66 60.75,99.25 v60.75,106.75
MISO  (via drill 0.3)
  Top 0.127: v35.5,35.5 42,29 45.75,29 46.25,29.5 R8.1 | v35,57 34.25,57.75 U1.2 34,58 8.75,58 8.75,63.25 U2.27 8.75,63.5 v7.75,64.5 | v99,49.25 106,49.25 107.5,50.75 D12.2 | v92.5,42.75 92,42.25 v35,42.25 | v7.75,96 6,97.75 J4.P7 | v21.5,5 21.5,3.75 TP6.TP
  Bottom 0.127: v35,57 v35,42.25 35,36 v35.5,35.5 35.5,19 v21.5,5 | v92.5,42.75 v99,49.25 | v7.75,64.5 v7.75,96
MOSI  (via drill 0.3)
  Top 0.127: v81.75,15 81.75,14.25 J1.14 | v93,10.5 101,2.5 TP7.TP | D11.2 46,34.75 44.75,36 v42.5,36 35,36 35,35.25 41.75,28.5 47.25,28.5 48.25,29.5 R7.1 48.5,29.5 72.5,29.5 v74.75,27.25 | v42,54.25 U1.5 | v42.5,43.75 20.25,43.75 20,44 15,44 v15,44.75 15,45.75 U2.7 | v10.25,93 6.25,93 6,93.25 J4.P3
  Bottom 0.127: v81.75,15 82,14.75 82,13 | 82,13 84.5,10.5 v93,10.5 | v42,54.25 42.5,53.75 v42.5,43.75 v42.5,36 | v10.25,93 15,88.25 v15,44.75 | 82,13 80,11 74.5,11 74.5,21 74.75,21.25 v74.75,27.25
N$1  (via drill 0.3)
  Top 0.127: D2.1 105.75,44.5 108.5,44.5 C1_BAT1.1 108.75,44.5 108.75,46.5 IC1.3 108.75,46.75 v109.5,46.75 | Q1.2 119.75,46.75 113.75,46.75 113.5,47 113.25,47 113.25,47.75 112,49 109.25,49 108.75,48.5 IC1.1 108.75,48.25 109,48.25 v109.5,47.75
  Bottom 0.127: v109.5,47.75 v109.5,46.75
N$3  (via drill 0.3)
  Top 0.127: v161,51.25 155.5,51.25 R2-USB1.2 | v162.5,52.75 163,53.25 163.5,53.25 J2.A5
  Bottom 0.127: v162.5,52.75 v161,51.25
N$5
  Top 0.127: C4.1 92,26.25 91.5,26.75 86.75,26.75 86.25,27.25 D4.1 86,27.5 83.25,27.5 83.25,28.5 D3.2
N$6  (via drill 0.3)
  Top 0.127: v150.75,50 R2-USB.1 | v162.5,55.75 163,56.25 163.5,56.25 J2.B5
  Bottom 0.127: v150.75,50 157.25,50 157.25,50.5 v162.5,55.75
N$7  (via drill 0.3)
  Top 0.127: v77.5,23.5 73.5,23.5 73.5,21.25 R1_BAT.2 | v115,54.75 113.5,54.75 MCP73831.1
  Bottom 0.127: v77.5,23.5 84,30 84,59.5 86.25,61.75 109,61.75 109,55.5 109.25,55.25 114,55.25 114,55.5 114.25,55.75 115,55.75 v115,54.75
N$8  (via drill 0.3)
  Top 0.127: v71,29 71,21.25 R2_BAT.2 | v109.5,55.75 110.5,54.75 MCP73831.5
  Bottom 0.127: v71,29 72.75,30.75 72.75,51.25 87.5,66 109.5,66 v109.5,55.75
N$9  (via drill 0.3)
  Top 0.127: v114.5,55.25 115,55.25 117.25,57.5 LED1.C | v93.5,32 91,29.5 77.75,29.5 72.25,24 72.25,20.25 73,20.25 73.25,20 R1_BAT.1
  Bottom 0.127: v114.5,55.25 106.75,47.5 106.75,45.25 v93.5,32
N$10  (via drill 0.3)
  Top 0.127: v76,14.25 76.75,14.25 J1.24 | v75,18.5 77.25,18.5 EPD_C12.2
  Bottom 0.127: v76,14.25 75,15.25 v75,18.5
N$11  (via drill 0.3)
  Top 0.127: v86.25,15.25 86.25,14.25 J1.5 | v86.25,19.25 86.5,19 87,19 87.5,18.5 EPD_C2.2
  Bottom 0.127: v86.25,19.25 v86.25,15.25
N$12
  Top 0.127: J1.4 86.75,14.25 86.75,15.25 93.25,15.25 93.5,15.5 93.5,17 90.25,17 89,18.25 EPD_C1.2
N$13  (via drill 0.3)
  Top 0.127: v75.5,15.5 79.75,15.5 79.75,14.25 J1.18 | v75.5,17 76.25,17.75 84.5,17.75 85,18.25 EPD_C6.2
  Bottom 0.127: v75.5,17 v75.5,15.5
N$14  (via drill 0.3)
  Top 0.127: v78,15 77.75,15 77.75,14.25 J1.22 | v78.25,19.5 78.75,19 79.5,19 80,18.5 EPD_C10.2
  Bottom 0.127: v78,15 78,19.25 v78.25,19.5
N$15  (via drill 0.3)
  Top 0.127: v79.5,13 78.75,13 78.75,14 J1.20 | v81.75,19.25 82.5,18.5 EPD_C8.2
  Bottom 0.127: v79.5,13 81,14.5 81,18.5 v81.75,19.25
N$16
  Top 0.127: R_CAPACITOR.1 85.75,48.5 86.75,49.5 93.75,49.5 95.25,51 D7.1
N$17  (via drill 0.3)
  Top 0.127: v83,13.25 82.75,13.5 79.25,13.5 79.25,14 J1.19 | EPD_C7.2 v83,19.25
  Bottom 0.127: v83,19.25 v83,13.25
N$18
  Top 0.127: IC2.5 34.5,98.75 34.75,99 37.5,99 37.5,97.25 37,97.25 C_DELAY.1
PREVGH  (via drill 0.3)
  Top 0.127: v79,15 78.75,15 78.25,14.5 78.25,14.25 J1.21 | 80.75,19 81.25,18.5 EPD_C9.2 | 80.75,19 v80.5,19.25 | 80.75,19 82.25,20.5 87.5,20.5 89.5,22.5 D5.1
  Bottom 0.127: v79,15 80.5,16.5 v80.5,19.25
PREVGL  (via drill 0.3)
  Top 0.127: v77.5,13.25 77.25,13.25 77.25,14 J1.23 | v77.5,19.25 77.75,19 78,19 78.5,18.5 EPD_C11.2 | v84,28 89,28 89.5,27.5 D4.2
  Bottom 0.127: v77.5,13.25 v77.5,19.25 77.5,21.5 v84,28
RESE  (via drill 0.3)
  Top 0.127: 87.25,13 87.25,12.75 80,12.75 79.5,12.25 68.25,12.25 66.5,14 Q3.2 | 87.25,13 87.25,14 J1.3 | v92,60.5 92.5,60.5 93.75,61.75 R3.2 | 87.25,13 v88.75,13
  Bottom 0.127: v92,60.5 88.75,57.25 v88.75,13
RESE'  (via drill 0.3)
  Top 0.127: SJ1.2 60.5,7.75 63,7.75 63.5,8.25 R2.2 63.5,8.5 65.5,10.5 78.25,10.5 80,12.25 89.5,12.25 v92,14.75 | v93.75,59.75 93.75,60.25 R3.1
  Bottom 0.127: v93.75,59.75 92,58 v92,14.75
RESET  (via drill 0.3)
  Top 0.127: RESET_BUTTON.3 25.75,109.75 22.5,109.75 RESET_BUTTON.4 22.25,109.5 20,109.5 17.5,107 | IC2.1 31.5,98.75 31.5,107 28,107 C5.1 27.75,107.25 20.5,107.25 R_RESET.1 20.25,107 17.5,107 | v9.75,48.25 9.75,46 U2.3 | v9.75,101.75 15,107 17.5,107
  Bottom 0.127: v9.75,101.75 v9.75,48.25
RTC_RST  (via drill 0.3)
  Top 0.127: v76.5,62.25 22.75,62.25 22.75,63.25 U2.16 | v79.75,59 80,58.75 85.25,58.75 85.5,59 85.5,60.5 U3.4
  Bottom 0.127: v79.75,59 v76.5,62.25
RX  (via drill 0.3)
  Top 0.127: v43.5,66.5 12.5,66.5 12.5,63.5 U2.24 | TP2.TP v85,108
  Bottom 0.127: v85,108 v43.5,66.5
SCK  (via drill 0.3)
  Top 0.127: v82.25,15.5 82.25,14.25 J1.13 | v94,11 104,1 109,1 110,2 TP8.TP | 33.5,54.75 33.5,49.25 32.5,48.25 R6.1 32.25,48 13.75,48 13.75,46 U2.6 | 33.5,54.75 40,54.75 41.75,56.5 U1.6 42,56.5 v43,55.5 | v48,37.75 48,34.75 D10.2 48.25,34.5 83.75,34.5 v88.25,30 | v10.25,95 6.5,95 6,95.5 J4.P5 | 33.5,54.75 v32.5,54.75
  Bottom 0.127: v82.25,15.5 82.5,15.25 82.5,13 84.5,11 88.25,11 | v94,11 88.25,11 | v48,37.75 43,42.75 v43,55.5 | v10.25,95 23.75,81.5 23.75,63.5 v32.5,54.75 | v88.25,30 88.25,11
SCL  (via drill 0.3)
  Top 0.127: R2-PINH.1 160,2 159.5,2.5 158.25,2.5 158,2.75 158,5.25 160.25,5.25 161.25,6.25 SENSOR2.4 161.5,6.5 166,6.5 166,19.25 165.25,20 164.75,20 164.5,20.25 J3.4 164.25,20.5 v164.25,21.25 | 127.5,58 127.25,57.75 126.5,57.75 U4.7 | 127.5,58 127.5,59.25 v92.5,59.25 89.25,62.5 85,62.5 82.5,65 17.75,65 17.75,63.5 U2.20 | v90.25,51.75 89.75,51.25 U3.16 | 127.5,58 v127.75,57.75
  Bottom 0.127: v92.5,59.25 90.25,57 v90.25,51.75 | v127.75,57.75 v164.25,21.25
SDA  (via drill 0.3)
  Top 0.127: R1_PINH.1 158.75,2 158.25,2 157.5,2.75 157.5,5.75 159.75,5.75 161,7 161.25,7 SENSOR2.3 161.5,7.25 165.5,7.25 165.5,18.75 165.25,19 164.75,19 164.5,19.25 J3.3 164.25,19.5 164,19.75 v163.25,19.75 | v89.5,52.75 88.5,51.75 88.5,51.25 U3.15 | U2.19 19,63.25 19,61 79.5,61 80.5,62 88.5,62 89,61.5 89,58.75 v91.25,58.75 125.75,58.75 126.25,58.25 U4.8 126.5,58.25 v127,58.25
  Bottom 0.127: v91.25,58.75 89.5,57 v89.5,52.75 | v163.25,19.75 127,56 v127,58.25
SRC  (via drill 0.3)
  Top 0.127: C4.2 92.25,27.5 92.75,27 92.75,23.25 86.75,23.25 86.25,22.75 D5.2 86,22.5 84.5,21 81.5,21 78.5,24 | v69.75,20 Q3.3 | v72.75,23.25 73.5,24 78.5,24 | 78.5,24 78.75,24 L1.1
  Bottom 0.127: v69.75,20 72.75,23 v72.75,23.25
SS_SD  (via drill 0.3)
  Top 0.127: 17.5,41.75 18,42.25 18,43.5 13.25,43.5 11,45.75 U2.4 11.25,46 v10.25,47 | 17.5,41.75 17.25,41.5 R10.1 17.5,41.75 | v87.75,64.75 87.75,65.5 D8.2 | 17.5,41.75 v82.75,41.75 | v10.25,88.25 6.25,92.25 J4.P2
  Bottom 0.127: v87.75,64.75 82.75,59.75 v82.75,41.75 | v10.25,47 v10.25,88.25
TX  (via drill 0.3)
  Top 0.127: v48,67 11.25,67 11.25,63.5 U2.25 | TP1.TP v89,108
  Bottom 0.127: v89,108 v48,67
USB_D+  (via drill 0.3)
  Top 0.127: v104.75,53 111,53 112.75,51.25 122.5,51.25 124.5,49.25 150.25,49.25 D1.1 | v97.25,45.5 24.25,45.5 24,45.75 U2.14
  Bottom 0.127: v97.25,45.5 v104.75,53
USB_D-
  Top 0.127: D1.3 150.25,47 146.5,43.25 43.75,43.25 42.25,44.75 23.25,44.75 22.75,45.25 22.75,45.75 U2.13
VBAT
  Top 0.127: 124.25,57.25 124.25,57.75 U4.2 | 122,54 122,57.25 124.25,57.25 | 122,54 122,52.5 | 122,52.5 122,52 Q1.3 | 124.25,57.25 U4.3 | 122,52.5 132,52.5 C2_BAT3.1 132.25,52.5 133,53.25 149.5,53.25 149.5,61.25 146.75,64 TP3.TP | 122,54 112.25,54 112.25,56 112.5,56.25 113,56.25 113.25,56.5 MCP73831.3
VBUS  (via drill 0.3)
  Top 0.127: D1.5 152.75,48 152.5,47.75 152.25,47.75 152,47.5 152,45.75 152.25,45.75 C4_USB.1 152.25,45.5 152.25,44.5 C5_USB.1 152.5,44.25 152.5,40.5 PFMF.050.1.2 152.5,40.25 150.5,38.25 v100.5,38.25 34.5,38.25 34.5,35.25 37,32.75 37,12.75 28.75,4.5 TP14.TP | C1_BAT.1 106,56 105.25,55.25 105.25,53.75 106.5,53.75 107,54.25 R1_PWRUSB.2 107.25,54.5 108.25,55.5 | 108.25,55.5 109,56.25 110.25,56.25 110.5,56.5 MCP73831.4 | v117.5,54.5 117.5,56 LED1.A | v120.25,50.5 120.75,50 Q1.1 | v107.75,47 105.75,47 D2.2 | 108.25,55.5 110.25,53.5 v113.75,53.5
  Bottom 0.127: v120.25,50.5 120.25,51.75 v117.5,54.5 117.5,54.25 115,54.25 114,53.25 | 114,53.25 v107.75,47 107.75,45.5 v100.5,38.25 | 114,53.25 v113.75,53.5
VRTC  (via drill 0.3)
  Top 0.127: v75.5,18 75,18 74.25,17.25 C8.1 | v76.75,47.5 86.25,47.5 R_CAPACITOR.2 | v85.25,63 86.25,63 86.75,63.5 C10_SUPERCAP.1 | v82,52.75 86.75,52.75 86.75,51.25 U3.14
  Bottom 0.127: v75.5,18 75.5,46.25 v76.75,47.5 v82,52.75 82.25,53 82.25,60 v85.25,63
VUSB  (via drill 0.3)
  Top 0.127: J2.A9 163.75,57 163.75,56.75 J2.B4 163.5,56.75 162.75,56.75 162,56 162,52.25 | 163.5,52.25 163.5,52 J2.A4 | 163.5,52.25 162,52.25 | 163.5,52.25 J2.B9 | 162,52.25 161.5,51.75 v159.5,51.75 | v149.5,41.75 148.25,40.5 PFMF.050.1.1
  Bottom 0.127: v149.5,41.75 v159.5,51.75